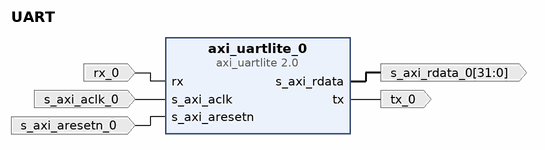
[diagram p0: block diagram of the top level]
# Vivado block design UART, xc7a35tcpg236-1, Vivado 2017.4.1
create_bd_design UART

create_bd_port -dir O tx_0
create_bd_port -dir I rx_0
create_bd_port -dir I -type clk s_axi_aclk_0
create_bd_port -dir I -type rst s_axi_aresetn_0
create_bd_port -dir O -from 31 -to 0 s_axi_rdata_0

create_bd_cell -type ip -vlnv xilinx.com:ip:axi_uartlite:2.0 axi_uartlite_0

# ---- connections ----

connect_bd_net [get_bd_pins axi_uartlite_0/tx] [get_bd_ports tx_0]
connect_bd_net -net rx_0_1 [get_bd_ports rx_0] [get_bd_pins axi_uartlite_0/rx]
connect_bd_net -net s_axi_aclk_0_1 [get_bd_ports s_axi_aclk_0] [get_bd_pins axi_uartlite_0/s_axi_aclk]
connect_bd_net -net s_axi_aresetn_0_1 [get_bd_ports s_axi_aresetn_0] [get_bd_pins axi_uartlite_0/s_axi_aresetn]
connect_bd_net [get_bd_pins axi_uartlite_0/s_axi_rdata] [get_bd_ports s_axi_rdata_0]

validate_bd_design
save_bd_design
